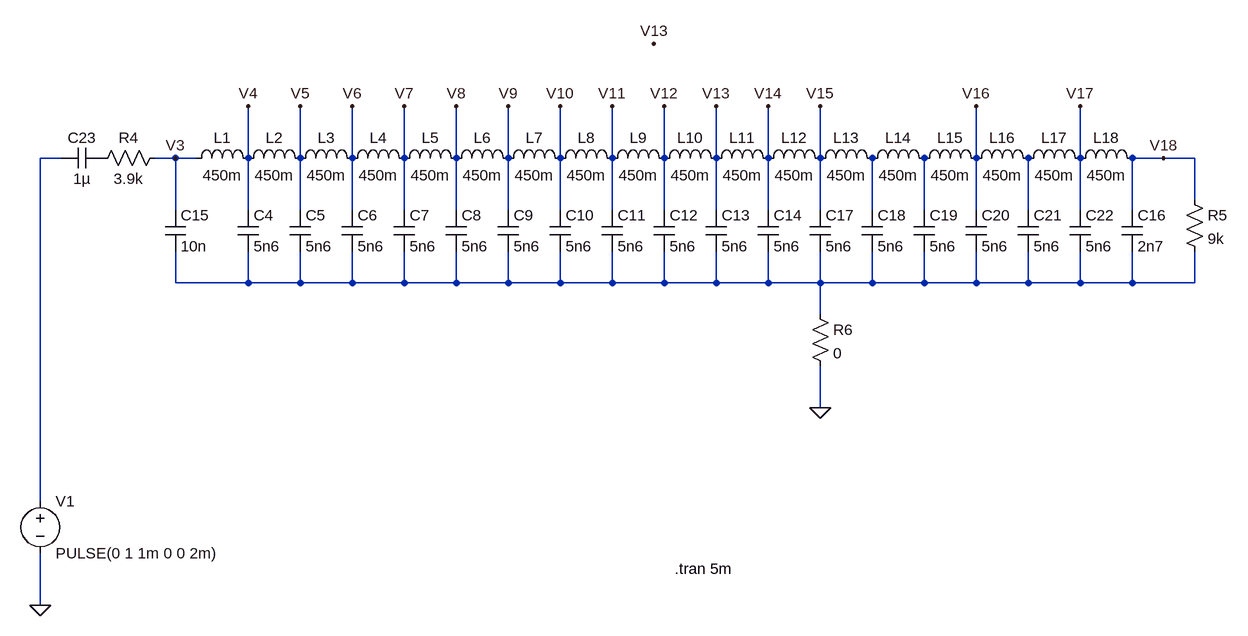
[diagram p0: schematic vibrato.asc]
vibrato.asc, the LTspice schematic file:
Version 4
SHEET 1 5945676 13421556
WIRE 912 -432 880 -432
WIRE 1088 -432 1056 -432
WIRE 1120 -432 1088 -432
WIRE 1200 -432 1200 -512
WIRE 1280 -432 1280 -512
WIRE 1360 -432 1360 -512
WIRE 1440 -432 1440 -512
WIRE 1520 -432 1520 -512
WIRE 1600 -432 1600 -512
WIRE 1680 -432 1680 -512
WIRE 1760 -432 1760 -512
WIRE 1840 -432 1840 -512
WIRE 1920 -432 1920 -512
WIRE 2000 -432 2000 -512
WIRE 2080 -432 2080 -512
WIRE 2320 -432 2320 -512
WIRE 2480 -432 2480 -512
WIRE 2608 -432 2560 -432
WIRE 2656 -432 2608 -432
WIRE 2656 -368 2656 -432
WIRE 1088 -352 1088 -432
WIRE 1200 -352 1200 -432
WIRE 1280 -352 1280 -432
WIRE 1360 -352 1360 -432
WIRE 1440 -352 1440 -432
WIRE 1520 -352 1520 -432
WIRE 1600 -352 1600 -432
WIRE 1680 -352 1680 -432
WIRE 1760 -352 1760 -432
WIRE 1840 -352 1840 -432
WIRE 1920 -352 1920 -432
WIRE 2000 -352 2000 -432
WIRE 2080 -352 2080 -432
WIRE 2160 -352 2160 -432
WIRE 2240 -352 2240 -432
WIRE 2320 -352 2320 -432
WIRE 2400 -352 2400 -432
WIRE 2480 -352 2480 -432
WIRE 2560 -352 2560 -432
WIRE 1088 -240 1088 -288
WIRE 1200 -240 1200 -288
WIRE 1200 -240 1088 -240
WIRE 1280 -240 1280 -288
WIRE 1280 -240 1200 -240
WIRE 1360 -240 1360 -288
WIRE 1360 -240 1280 -240
WIRE 1440 -240 1440 -288
WIRE 1440 -240 1360 -240
WIRE 1520 -240 1520 -288
WIRE 1520 -240 1440 -240
WIRE 1600 -240 1600 -288
WIRE 1600 -240 1520 -240
WIRE 1680 -240 1680 -288
WIRE 1680 -240 1600 -240
WIRE 1760 -240 1760 -288
WIRE 1760 -240 1680 -240
WIRE 1840 -240 1840 -288
WIRE 1840 -240 1760 -240
WIRE 1920 -240 1920 -288
WIRE 1920 -240 1840 -240
WIRE 2000 -240 2000 -288
WIRE 2000 -240 1920 -240
WIRE 2080 -240 2080 -288
WIRE 2080 -240 2000 -240
WIRE 2160 -240 2160 -288
WIRE 2160 -240 2080 -240
WIRE 2240 -240 2240 -288
WIRE 2240 -240 2160 -240
WIRE 2320 -240 2320 -288
WIRE 2320 -240 2240 -240
WIRE 2400 -240 2400 -288
WIRE 2400 -240 2320 -240
WIRE 2480 -240 2480 -288
WIRE 2480 -240 2400 -240
WIRE 2560 -240 2560 -288
WIRE 2560 -240 2480 -240
WIRE 2656 -240 2656 -288
WIRE 2656 -240 2560 -240
WIRE 2080 -192 2080 -240
WIRE 2080 -48 2080 -112
WIRE 880 96 880 -432
WIRE 880 256 880 176
FLAG 880 256 0
FLAG 2608 -432 V18
FLAG 2480 -512 V17
FLAG 2320 -512 V16
FLAG 2080 -512 V15
FLAG 2000 -512 V14
FLAG 1920 -512 V13
FLAG 1824 -608 V13
FLAG 1840 -512 V12
FLAG 1760 -512 V11
FLAG 1680 -512 V10
FLAG 1600 -512 V9
FLAG 1520 -512 V8
FLAG 1440 -512 V7
FLAG 1360 -512 V6
FLAG 1280 -512 V5
FLAG 1200 -512 V4
FLAG 1088 -432 V3
FLAG 2080 -48 0
SYMBOL voltage 880 80 R0
WINDOW 123 24 124 Left 2
WINDOW 39 0 0 Left 0
SYMATTR InstName V1
SYMATTR Value PULSE(0 1 1m 0 0 2m)
SYMBOL ind 1104 -416 R270
WINDOW 0 32 56 VTop 2
WINDOW 3 5 56 VBottom 2
SYMATTR InstName L1
SYMATTR Value 450m
SYMATTR SpiceLine Rser=230
SYMBOL cap 1184 -352 R0
SYMATTR InstName C4
SYMATTR Value 5n6
SYMBOL cap 1264 -352 R0
SYMATTR InstName C5
SYMATTR Value 5n6
SYMBOL cap 1344 -352 R0
SYMATTR InstName C6
SYMATTR Value 5n6
SYMBOL cap 1424 -352 R0
SYMATTR InstName C7
SYMATTR Value 5n6
SYMBOL cap 1504 -352 R0
SYMATTR InstName C8
SYMATTR Value 5n6
SYMBOL cap 1584 -352 R0
SYMATTR InstName C9
SYMATTR Value 5n6
SYMBOL cap 1664 -352 R0
SYMATTR InstName C10
SYMATTR Value 5n6
SYMBOL cap 1744 -352 R0
SYMATTR InstName C11
SYMATTR Value 5n6
SYMBOL cap 1824 -352 R0
SYMATTR InstName C12
SYMATTR Value 5n6
SYMBOL cap 1904 -352 R0
SYMATTR InstName C13
SYMATTR Value 5n6
SYMBOL cap 1984 -352 R0
SYMATTR InstName C14
SYMATTR Value 5n6
SYMBOL res 1072 -448 R90
WINDOW 0 0 56 VBottom 2
WINDOW 3 32 56 VTop 2
SYMATTR InstName R4
SYMATTR Value 3.9k
SYMBOL res 2640 -384 R0
SYMATTR InstName R5
SYMATTR Value 9k
SYMBOL cap 1072 -352 R0
SYMATTR InstName C15
SYMATTR Value 10n
SYMBOL cap 2064 -352 R0
SYMATTR InstName C17
SYMATTR Value 5n6
SYMBOL cap 2144 -352 R0
SYMATTR InstName C18
SYMATTR Value 5n6
SYMBOL cap 2224 -352 R0
SYMATTR InstName C19
SYMATTR Value 5n6
SYMBOL cap 2304 -352 R0
SYMATTR InstName C20
SYMATTR Value 5n6
SYMBOL cap 2384 -352 R0
SYMATTR InstName C21
SYMATTR Value 5n6
SYMBOL cap 2464 -352 R0
SYMATTR InstName C22
SYMATTR Value 5n6
SYMBOL cap 2544 -352 R0
SYMATTR InstName C16
SYMATTR Value 2n7
SYMBOL cap 976 -448 R90
WINDOW 0 0 32 VBottom 2
WINDOW 3 32 32 VTop 2
SYMATTR InstName C23
SYMATTR Value 1µ
SYMBOL res 2064 -208 R0
SYMATTR InstName R6
SYMATTR Value 0
SYMBOL ind 1184 -416 R270
WINDOW 0 32 56 VTop 2
WINDOW 3 5 56 VBottom 2
SYMATTR InstName L2
SYMATTR Value 450m
SYMATTR SpiceLine Rser=230
SYMBOL ind 1264 -416 R270
WINDOW 0 32 56 VTop 2
WINDOW 3 5 56 VBottom 2
SYMATTR InstName L3
SYMATTR Value 450m
SYMATTR SpiceLine Rser=230
SYMBOL ind 1344 -416 R270
WINDOW 0 32 56 VTop 2
WINDOW 3 5 56 VBottom 2
SYMATTR InstName L4
SYMATTR Value 450m
SYMATTR SpiceLine Rser=230
SYMBOL ind 1424 -416 R270
WINDOW 0 32 56 VTop 2
WINDOW 3 5 56 VBottom 2
SYMATTR InstName L5
SYMATTR Value 450m
SYMATTR SpiceLine Rser=230
SYMBOL ind 1504 -416 R270
WINDOW 0 32 56 VTop 2
WINDOW 3 5 56 VBottom 2
SYMATTR InstName L6
SYMATTR Value 450m
SYMATTR SpiceLine Rser=230
SYMBOL ind 1584 -416 R270
WINDOW 0 32 56 VTop 2
WINDOW 3 5 56 VBottom 2
SYMATTR InstName L7
SYMATTR Value 450m
SYMATTR SpiceLine Rser=230
SYMBOL ind 1664 -416 R270
WINDOW 0 32 56 VTop 2
WINDOW 3 5 56 VBottom 2
SYMATTR InstName L8
SYMATTR Value 450m
SYMATTR SpiceLine Rser=230
SYMBOL ind 1744 -416 R270
WINDOW 0 32 56 VTop 2
WINDOW 3 5 56 VBottom 2
SYMATTR InstName L9
SYMATTR Value 450m
SYMATTR SpiceLine Rser=230
SYMBOL ind 1824 -416 R270
WINDOW 0 32 56 VTop 2
WINDOW 3 5 56 VBottom 2
SYMATTR InstName L10
SYMATTR Value 450m
SYMATTR SpiceLine Rser=230
SYMBOL ind 1904 -416 R270
WINDOW 0 32 56 VTop 2
WINDOW 3 5 56 VBottom 2
SYMATTR InstName L11
SYMATTR Value 450m
SYMATTR SpiceLine Rser=230
SYMBOL ind 1984 -416 R270
WINDOW 0 32 56 VTop 2
WINDOW 3 5 56 VBottom 2
SYMATTR InstName L12
SYMATTR Value 450m
SYMATTR SpiceLine Rser=230
SYMBOL ind 2064 -416 R270
WINDOW 0 32 56 VTop 2
WINDOW 3 5 56 VBottom 2
SYMATTR InstName L13
SYMATTR Value 450m
SYMATTR SpiceLine Rser=230
SYMBOL ind 2144 -416 R270
WINDOW 0 32 56 VTop 2
WINDOW 3 5 56 VBottom 2
SYMATTR InstName L14
SYMATTR Value 450m
SYMATTR SpiceLine Rser=230
SYMBOL ind 2224 -416 R270
WINDOW 0 32 56 VTop 2
WINDOW 3 5 56 VBottom 2
SYMATTR InstName L15
SYMATTR Value 450m
SYMATTR SpiceLine Rser=230
SYMBOL ind 2304 -416 R270
WINDOW 0 32 56 VTop 2
WINDOW 3 5 56 VBottom 2
SYMATTR InstName L16
SYMATTR Value 450m
SYMATTR SpiceLine Rser=230
SYMBOL ind 2384 -416 R270
WINDOW 0 32 56 VTop 2
WINDOW 3 5 56 VBottom 2
SYMATTR InstName L17
SYMATTR Value 450m
SYMATTR SpiceLine Rser=230
SYMBOL ind 2464 -416 R270
WINDOW 0 32 56 VTop 2
WINDOW 3 5 56 VBottom 2
SYMATTR InstName L18
SYMATTR Value 450m
SYMATTR SpiceLine Rser=230
TEXT 1856 200 Left 2 !.tran 5m

The netlist it stands for:
* vibrato.asc
V1 N001 0 PULSE(0 1 1m 0 0 2m)
L1 V3 V4 450m Rser=230
C4 V4 N005 5n6
C5 V5 N005 5n6
C6 V6 N005 5n6
C7 V7 N005 5n6
C8 V8 N005 5n6
C9 V9 N005 5n6
C10 V10 N005 5n6
C11 V11 N005 5n6
C12 V12 N005 5n6
C13 V13 N005 5n6
C14 V14 N005 5n6
R4 V3 P001 3.9k
R5 V18 N005 9k
C15 V3 N005 10n
C17 V15 N005 5n6
C18 N002 N005 5n6
C19 N003 N005 5n6
C20 V16 N005 5n6
C21 N004 N005 5n6
C22 V17 N005 5n6
C16 V18 N005 2n7
C23 P001 N001 1µ
R6 N005 0 0
L2 V4 V5 450m Rser=230
L3 V5 V6 450m Rser=230
L4 V6 V7 450m Rser=230
L5 V7 V8 450m Rser=230
L6 V8 V9 450m Rser=230
L7 V9 V10 450m Rser=230
L8 V10 V11 450m Rser=230
L9 V11 V12 450m Rser=230
L10 V12 V13 450m Rser=230
L11 V13 V14 450m Rser=230
L12 V14 V15 450m Rser=230
L13 V15 N002 450m Rser=230
L14 N002 N003 450m Rser=230
L15 N003 V16 450m Rser=230
L16 V16 N004 450m Rser=230
L17 N004 V17 450m Rser=230
L18 V17 V18 450m Rser=230
.tran 5m
.backanno
.end